# EAGLE board zx81a (EAGLE 7.6.0), part 1 of 3
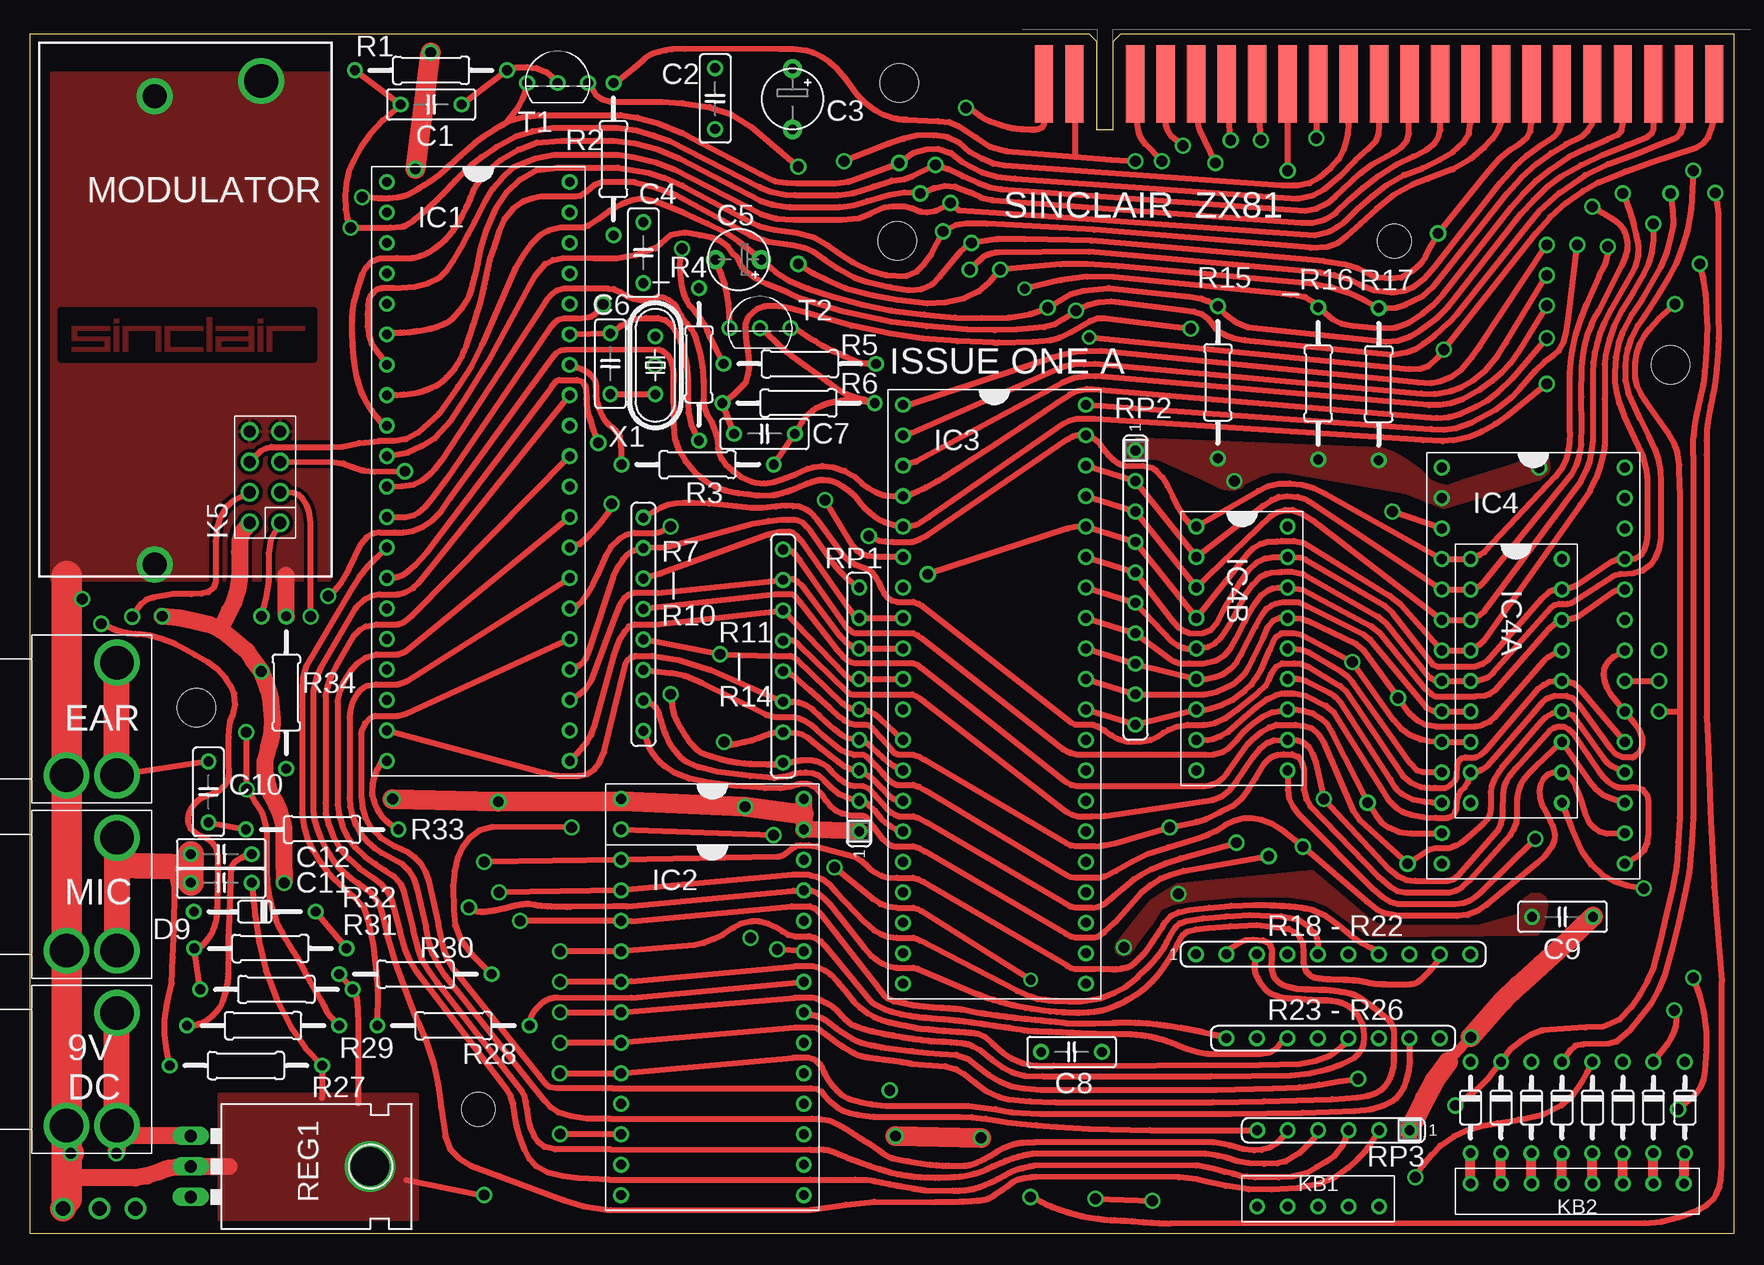
[diagram p1: board, top side]
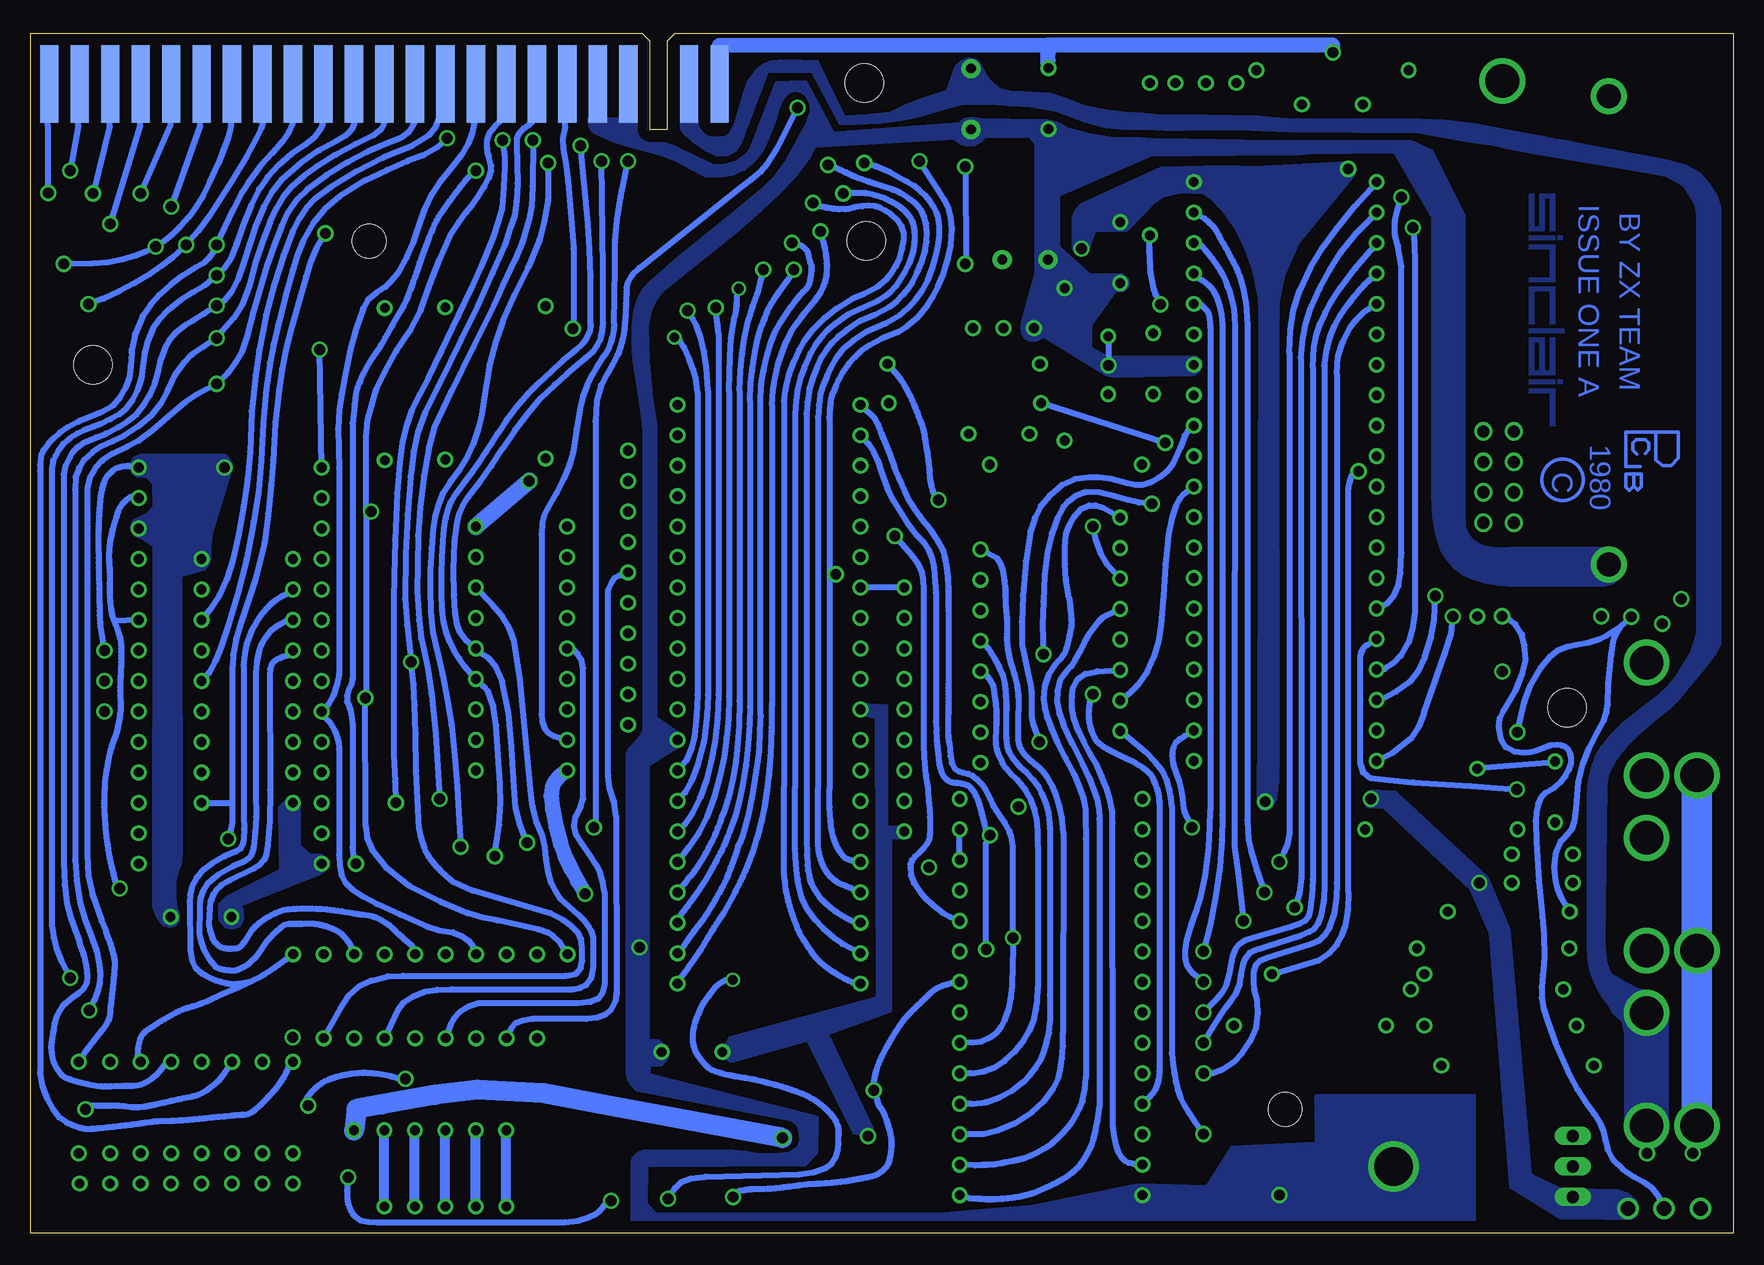
[diagram p2: board, bottom side, seen from below]

Size 142 x 100 mm. Coordinates in mm from the lower left corner, seen from the top.
Outline: 0,0 0,100 88.27,100 88.9,99.37 88.9,92 90.3,92 90.3,99.37 90.94,100 142,100 142,0 0,0
Copper layers (1*16): Top 0.035mm / dielectric 1.5mm / Bottom 0.035mm
Design rules "default *": minimum track width 10mil, minimum drill 24mil, track to track 8mil, track to pad 8mil, pad to pad 8mil, via to via 8mil, smd to smd 8mil, copper to edge 40mil, drill to drill 8mil, minimum pad ring 10mil, minimum via ring 8mil, stop-mask expansion 4mil, vias tented up to drill 0mil, thermal gap 10mil
Holes 3.2 mm at 13.88,43.81 72.45,95.88 72.3,82.71 136.75,72.39
Holes 2.8 mm at 113.73,82.71 37.37,10.31
tRestrict: 4 lines

## Footprints (pad centres in the part's own frame; a part is rotated, then mirrored left to right if it is on the bottom)
R207/12 = drill 0.813: 1 -6.35,0; 2 6.35,0
C025-025X050 = drill 0.813: 1 -2.54,0; 2 2.54,0
E5-5 = drill 0.813 pad 1.6: + -2.54,0; - 2.54,0
E3,8-5 = drill 0.813 pad 1.6: + -1.905,0; - 1.905,0
D10 = drill 0.813: A 3.81,0; C -3.81,0
D15 = drill 0.813: A 5.08,0; C -5.08,0
DIL40 = drill 0.813: 1 -7.62,24.13; 2 -7.62,21.59; 3 -7.62,19.05; 4 -7.62,16.51; 5 -7.62,13.97; 6 -7.62,11.43; 7 -7.62,8.89; 8 -7.62,6.35; 9 -7.62,3.81; 10 -7.62,1.27; 11 -7.62,-1.27; 12 -7.62,-3.81; 13 -7.62,-6.35; 14 -7.62,-8.89; 15 -7.62,-11.43; 16 -7.62,-13.97; 17 -7.62,-16.51; 18 -7.62,-19.05; 19 -7.62,-21.59; 20 -7.62,-24.13; 21 7.62,-24.13; 22 7.62,-21.59; 23 7.62,-19.05; 24 7.62,-16.51; 25 7.62,-13.97; 26 7.62,-11.43; 27 7.62,-8.89; 28 7.62,-6.35; 29 7.62,-3.81; 30 7.62,-1.27; 31 7.62,1.27; 32 7.62,3.81; 33 7.62,6.35; 34 7.62,8.89; 35 7.62,11.43; 36 7.62,13.97; 37 7.62,16.51; 38 7.62,19.05; 39 7.62,21.59; 40 7.62,24.13
DIL24/28 = drill 0.813: 1 -7.62,13.97; 2 -7.62,11.43; 3 -7.62,8.89; 4 -7.62,6.35; 5 -7.62,3.81; 6 -7.62,1.27; 7 -7.62,-1.27; 8 -7.62,-3.81; 9 -7.62,-6.35; 10 -7.62,-8.89; 11 -7.62,-11.43; 12 -7.62,-13.97; 13 -7.62,-16.51; 14 -7.62,-19.05; 15 7.62,-19.05; 16 7.62,-16.51; 17 7.62,-13.97; 18 7.62,-11.43; 19 7.62,-8.89; 20 7.62,-6.35; 21 7.62,-3.81; 22 7.62,-1.27; 23 7.62,1.27; 24 7.62,3.81; 25 7.62,6.35; 26 7.62,8.89; 27 7.62,11.43; 28 7.62,13.97
DIL28 = drill 0.813: 1 -7.62,13.97; 2 -7.62,11.43; 3 -7.62,8.89; 4 -7.62,6.35; 5 -7.62,3.81; 6 -7.62,1.27; 7 -7.62,-1.27; 8 -7.62,-3.81; 9 -7.62,-6.35; 10 -7.62,-8.89; 11 -7.62,-11.43; 12 -7.62,-13.97; 13 -7.62,-16.51; 14 -7.62,-19.05; 15 7.62,-19.05; 16 7.62,-16.51; 17 7.62,-13.97; 18 7.62,-11.43; 19 7.62,-8.89; 20 7.62,-6.35; 21 7.62,-3.81; 22 7.62,-1.27; 23 7.62,1.27; 24 7.62,3.81; 25 7.62,6.35; 26 7.62,8.89; 27 7.62,11.43; 28 7.62,13.97
DIL18 = drill 0.813: 1 -3.81,10.16; 2 -3.81,7.62; 3 -3.81,5.08; 4 -3.81,2.54; 5 -3.81,0; 6 -3.81,-2.54; 7 -3.81,-5.08; 8 -3.81,-7.62; 9 -3.81,-10.16; 10 3.81,-10.16; 11 3.81,-7.62; 12 3.81,-5.08; 13 3.81,-2.54; 14 3.81,0; 15 3.81,2.54; 16 3.81,5.08; 17 3.81,7.62; 18 3.81,10.16
ZX81CON = smd 1.524 x 6.477: A1 -27.94,-2.54; A2 -25.4,-2.54; A4 -20.32,-2.54; A5 -17.78,-2.54; A6 -15.24,-2.54; A7 -12.7,-2.54; A8 -10.16,-2.54; A9 -7.62,-2.54; A10 -5.08,-2.54; A11 -2.54,-2.54; A12 0,-2.54; A13 2.54,-2.54; A14 5.08,-2.54; A15 7.62,-2.54; A16 10.16,-2.54; A17 12.7,-2.54; A18 15.24,-2.54; A19 17.78,-2.54; A20 20.32,-2.54; A21 22.86,-2.54; A22 25.4,-2.54; A23 27.94,-2.54 | smd 1.524 x 6.477 bottom: B1 -27.94,-2.54; B2 -25.4,-2.54; B4 -20.32,-2.54; B5 -17.78,-2.54; B6 -15.24,-2.54; B7 -12.7,-2.54; B8 -10.16,-2.54; B9 -7.62,-2.54; B10 -5.08,-2.54; B11 -2.54,-2.54; B12 0,-2.54; B13 2.54,-2.54; B14 5.08,-2.54; B15 7.62,-2.54; B16 10.16,-2.54; B17 12.7,-2.54; B18 15.24,-2.54; B19 17.78,-2.54; B20 20.32,-2.54; B21 22.86,-2.54; B22 25.4,-2.54; B23 27.94,-2.54
ZXKLINKE = drill 2.8: 1 2.1,-4.7; 1' 2.1,4.7; 2 -2.1,-4.7
PINHEAD2X4 = drill 1.016: 1 -7.62,0; 2 -7.62,2.54; 3 -5.08,0; 4 -5.08,2.54; 5 -2.54,0; 6 -2.54,2.54; 7 0,0; 8 0,2.54
ZXKDB5 = drill 0.8: P$1 -5.08,0; P$2 -2.54,0; P$3 0,0; P$4 2.54,0; P$5 5.08,0
ZXKBD8 = drill 0.8: P$1 -8.89,0; P$2 -6.35,0; P$3 -3.81,0; P$4 -1.27,0; P$5 1.27,0; P$6 3.81,0; P$7 6.35,0; P$8 8.89,0
78XXL = drill 1.016 long: GND 0,0; IN -2.54,0; OUT 2.54,0
SIL9 = drill 0.813: 1 -10.16,0; 2 -7.62,0; 3 -5.08,0; 4 -2.54,0; 5 0,0; 6 2.54,0; 7 5.08,0; 8 7.62,0; 9 10.16,0
SIL10 = drill 0.813: 1 -11.43,0; 2 -8.89,0; 3 -6.35,0; 4 -3.81,0; 5 -1.27,0; 6 1.27,0; 7 3.81,0; 8 6.35,0; 9 8.89,0; 10 11.43,0
SIL6 = drill 0.813: 1 -6.35,0; 2 -3.81,0; 3 -1.27,0; 4 1.27,0; 5 3.81,0; 6 6.35,0
SIL8P = drill 0.813: 1 -8.89,0; 2 -6.35,0; 3 -3.81,0; 4 -1.27,0; 5 1.27,0; 6 3.81,0; 7 6.35,0; 8 8.89,0
SIL10P = drill 0.813: 1 -11.43,0; 2 -8.89,0; 3 -6.35,0; 4 -3.81,0; 5 -1.27,0; 6 1.27,0; 7 3.81,0; 8 6.35,0; 9 8.89,0; 10 11.43,0
TO92FLAT = drill 0.813: 1 0,0; 2 2.54,0; 3 -2.54,0
HC49 = drill 0.813: 1 -2.413,0; 2 2.413,0

## Placement (x,y rotation side)
_R4  18k  [R207/12]  55.76,72.42 270 top
_R16  [R207/12]  107.39,70.83 90 top
C1  47p  [C025-025X050]  33.44,94.09 0 top
C2  100n  [C025-025X050]  57.11,94.58 270 top
C3  22µ/16V  [E5-5]  63.56,94.54 270 top
C4  100n  [C025-025X050]  51.13,81.73 270 top
C5  1µ  [E3,8-5]  59.05,81.16 180 top
C6  [C025-025X050]  48.38,72.47 270 top
C7  47p  [C025-025X050]  61.22,66.64 0 top
C8  100n  [C025-025X050]  86.82,15.1 0 top
C9  100n  [C025-025X050]  127.74,26.37 180 top
C10  10n  [C025-025X050]  14.87,36.78 270 top
C11  47n  [C025-025X050]  15.94,29.21 0 top
C12  47p  [C025-025X050]  15.94,31.59 0 top
D1  [D10]  120.08,10.47 270 top
D2  [D10]  122.62,10.47 270 top
D3  [D10]  125.16,10.47 270 top
D4  [D10]  127.7,10.47 270 top
D5  [D10]  130.24,10.47 270 top
D6  [D10]  132.78,10.47 270 top
D7  [D10]  135.32,10.47 270 top
D8  [D10]  137.94,10.46 270 top
D9  [D15]  18.74,26.79 180 top
IC1  ZX81ULA  [DIL40]  37.37,63.5 0 top
IC2  ZX81ROM  [DIL24/28]  56.89,22.22 0 top
IC3  Z80CPU  [DIL40]  80.39,44.92 0 top
IC4  4816  [DIL28]  125.32,49.84 0 top
IC4A  2114  [DIL18]  123.89,46.03 0 top
IC4B  2114  [DIL18]  101.03,48.73 0 top
K1  ZX81CONN  [ZX81CON]  112.45,98.34 0 top
K2  MIC  [ZXKLINKE]  5.14,28.25 0 top
K3  EAR  [ZXKLINKE]  5.14,42.86 0 top
K4  DCIN  [ZXKLINKE]  5.14,13.65 0 top
K5  PINHEAD-2X4  [PINHEAD2X4]  20.86,66.83 90 top
KB1  ZXKBD5CON  [ZXKDB5]  107.38,2.22 180 top
KB2  ZXKBD8CON  [ZXKBD8]  128.97,4.12 0 top
R1  10k  [R207/12]  33.43,96.93 0 top
R2  680  [R207/12]  48.64,89.53 90 top
R3  not used  [R207/12]  55.65,64.07 0 top
R5  330  [R207/12]  64.17,72.47 180 top
R6  2k2  [R207/12]  64.07,69.2 0 top
R15  220k  [R207/12]  99.02,70.93 270 top
R17  1k  [R207/12]  112.43,70.77 270 top
R27  1k  [R207/12]  18,13.97 180 top
R28  680  [R207/12]  35.31,17.3 0 top
R29  1M  [R207/12]  19.43,17.3 0 top
R30  [R207/12]  32.13,21.59 180 top
R31  [R207/12]  20.54,20.32 180 top
R32  [R207/12]  20.04,23.73 0 top
R33  4k7  [R207/12]  24.35,33.65 0 top
R34  220  [R207/12]  21.36,45.06 270 top
REG1  7805  [78XXL]  13.4,5.55 270 top
RP1  not used  [SIL9]  69.12,43.65 90 top
RP2  10k  [SIL10]  92.14,53.81 270 top
RP3  RSIL5  [SIL6]  108.65,8.57 180 top
RP4  470  [SIL8P]  51.12,50.75 270 top
RP5  470  [SIL8P]  62.78,48.11 270 top
RP6  1k  [SIL8P]  108.62,16.25 0 top
RP7  [SIL10P]  108.62,23.25 0 top
T1  [TO92FLAT]  43.98,95.88 0 top
T2  [TO92FLAT]  60.85,75.44 0 top
X1  6,5MHz  [HC49]  52.12,72.34 270 top

## Tracks (layer width: path | path; a pad name or v marks a point on that pad's centre or on a via)
+5V  (via drill 0.9, 1.2)
  Top 0.5: R5.2 57.24,73.57 56.75,74.54 56.45,75.3 56.24,75.73 55.91,76.22 55.47,76.77 55.02,77.29 54.73,77.78 54.53,78.29 54.35,78.91 54.27,79.52 54.2,80.53 54.23,81.35 54.27,82.19 v54.36,82.07 | 49.28,36.03 IC2.1 | IC2.28
  Top 0.813: v120.1,16.33 118.22,14.26
  Top 1.422: IC2.28 64.52,34.92 IC2.27 RP1.1 | v11.02,51.43 12.39,51.31 13.79,51.02 15,50.73 15.84,50.3 | 15.84,50.3 16.07,50.18 16.73,49.65 17.47,49.01 18.07,48.53 18.57,47.76 v19.27,46.83 19.8,45.42 20.01,44.71 20.2,42.87 20.14,41.6 19.89,40.57 19.56,39.34 19.57,38.32 19.89,36.91 20.55,35.69 20.79,35.21 21.13,33.93 21.15,31.47 v21.18,29.21 | K5.2 17.68,58.43 17.5,57.7 17.46,56.76 17.46,54.77 17.32,53.65 16.99,52.59 16.59,51.83 15.84,50.3
  Top 1.676: v32.13,88.71 v33.4,98.42 | v30.23,36.19 v39.05,35.97 49.28,36.03 v59.59,35.56 64.52,34.92 | v120.1,16.33 122.78,19.34 124.06,20.62 125.94,22.32 128.27,24.43 C9.1 | 118.22,14.26 117.05,12.68 116.26,11.21 RP3.1 | v72.14,8.09 v79.28,7.93
  Bottom 0.5: IC4.28 133.61,63.94 133.79,63.93 133.97,63.92 134.15,63.91 134.33,63.88 134.5,63.85 134.66,63.8 134.81,63.74 134.96,63.65 135.09,63.55 135.22,63.44 135.35,63.32 135.47,63.2 135.59,63.07 135.69,62.94 135.75,62.81 135.81,62.67 135.86,62.52 135.9,62.37 135.94,62.22 135.98,62.08 136.02,61.93 136.07,61.7 136.1,61.46 136.13,61.22 136.16,60.98 136.18,60.74 136.2,60.5 136.22,60.26 136.24,60.04 136.25,59.82 136.26,59.6 136.27,59.38 136.27,59.16 136.28,58.94 136.29,58.72 136.29,58.38 136.3,58.03 136.3,57.69 136.29,57.34 136.29,57 136.29,56.65 136.29,56.31 136.28,55.88 136.27,55.45 136.26,55.02 136.25,54.59 136.24,54.16 136.23,53.73 136.22,53.3 136.21,52.94 136.21,52.59 136.21,52.24 136.2,51.88 136.2,51.53 136.18,51.17 136.15,50.82 136.13,50.57 136.09,50.32 136.06,50.07 136.02,49.83 135.97,49.58 135.93,49.33 135.89,49.08 v135.79,48.57 | IC2.26 IC2.27
  Bottom 1.27: v33.4,98.42 33.4,99.03 57.11,99.03 | C2.1 arc5 57.11,99.03 | 57.11,99.03 84.54,99 K1.B1
  Bottom 1.422: IC4B.18 v100.39,62.7
  Bottom 1.676: v79.28,7.93 94.59,10.79 99.19,11.66 104.72,11.96 108.27,11.51 112.67,10.72 114.78,10.34 RP3.1
  other vias: 125.79,63.81 8.79,2.06
  pour Top (no thermals): 92.61,66.19 112.62,65.4 113.57,65.08 114.68,64.45 115.79,63.66 116.75,62.7 117.38,62.38 118.17,62.23 119.44,62.7 123.57,63.97 124.84,64.45 125.95,64.77 126.43,64.61 126.59,64.13 126.59,63.66 126.43,63.34 125.79,62.86 117.86,60.48 114.68,61.75 105.63,63.34 104.52,63.5 103.57,63.5 102.62,63.18 101.25,62.51 100.94,62.19 100.66,62.11 100.17,62 99.59,62.08 99.12,62.23 97.85,62.86 94.36,64.45 93.89,64.61 91.82,64.61 91.5,64.93 91.34,65.24 91.34,65.56 91.66,65.88 92.3,66.19
  pour Bottom (no thermals): 72.78,44.07 70.61,43.96 70.61,33.81 68.77,33.81 68.77,33 70.29,33 70.29,18.51 75.55,16.61 71.81,8.74 72.08,8.09 73.33,8.36 77.18,16.12 83.52,14.33 84.34,14.88 83.63,16.29 71.37,19.6 71.43,42.93 72.89,43.41 72.79,44.06 71.75,43.62
  pour Bottom (no thermals): 13.36,3.63 9.63,3.52 8.83,3.23 8.22,2.73 8.02,2.1 8.14,1.5 8.63,1.2 10.65,1.25 14.39,1.26 18.57,3.87 20.29,25.02 21.86,28.66 29.24,35.57 30.07,35.57 30.53,35.57 30.74,36.01 30.74,36.38 30.48,36.72 30.05,36.85 28.2,36.75 20.55,29.66 18.74,25.33 16.93,4.87 14.45,3.67 13.38,3.65
  pour Bottom (no thermals): 32,89.25 39.91,88.81 42.34,88.92 47.71,88.77 54.34,85.75 54.75,85.29 55.02,84.65 55.02,82.14 54.71,81.65 54.19,81.58 53.89,81.84 53.28,83.58 51.74,83.6 51.24,83.58 51.14,83.58 50.82,83.6 50.62,83.6 50.4,83.8 48.35,85.9 47.6,86.42 46.69,86.69 45.75,86.8 44.21,86.72 43.53,86.27 42.47,85.18 41.5,83.79 40.63,82.13 40.06,80.47 39.86,79.68 39.68,78.7 39.54,78.01 39.49,76.8 39.56,40.67 39.6,37.61 39.61,35.82 39.35,35.37 38.87,35.34 38.56,35.52 38.31,35.91 38.2,36.17 38.14,36.61 38.02,37.58 37.97,40.1 38.03,74.14 38,77.63 37.54,79.83 36.35,82.47 31.78,88.07 31.52,88.67 31.69,89.11
  pour Bottom (no thermals): 125.88,64.85 132.79,64.83 133.25,64.64 133.51,64.16 133.53,63.77 133.44,63.42 133.07,63.11 132.24,63.07 131.68,62.48 131.63,60.56 132.22,59.89 132.79,59.67 133.36,59.34 133.51,58.88 133.46,58.51 133.16,58.14 132.57,57.88 131.66,57.29 131.68,27.22 131.33,26.27 130.92,25.74 130.37,25.59 129.85,25.72 129.63,26.03 129.63,26.55 129.85,27.16 129.96,27.96 129.96,29.4 129.74,30.14 129.5,30.8 129.41,31.6 129.43,54.83 127.47,55.38 127.23,55.64 127.04,56.18 127.04,57.08 126.91,58.36 125.32,63.53 125.23,64.05 125.36,64.4 125.62,64.72
+9V  (via drill 0.9)
  Top 1.422: REG1.IN 7.53,8.09 | 7.53,8.09 7.21,8.09 K4.1 | v7.21,6.66 7.53,8.09
  Top 2.184: K4.1 K4.1'
  pour Bottom (no thermals): 7.1,7.08 7.9,7.31 8.35,7.66 8.79,8.16 8.99,8.9 8.99,16.62 9.19,17.64 9.97,18.37 10.31,19 10.84,19.7 11.41,20.64 11.86,21.79 12.04,22.6 12.12,23.73 12.12,36.57 12.01,37.61 11.81,38.58 11.39,39.76 10.92,40.57 10.18,41.48 9.22,42.45 7.41,43.89 6.18,44.83 5.4,45.56 4.64,46.5 3.52,48.26 3,50 3,59 2.98,84.82 3.09,85.69 3.48,86.42 4.03,87.22 4.78,87.75 5.66,88.19 6.99,88.43 16.61,90.05 18.75,90.49 20.03,90.77 21.32,90.94 22.66,91.14 26.26,91.81 37.11,91.9 41.35,92.05 42.84,92.07 44.54,92.06 46.76,92 48.85,92.12 50.91,92.1 52.31,92.25 53.97,92.68 56.44,93.6 57.69,93.83 58.53,93.96 60.25,94.07 61.87,94.2 64.23,94.2 65.82,93.78 68.04,93.13 69.56,92.81 71.16,92.63 73.14,92.51 74.45,92.47 76.75,96.87 80.56,96.81 82.79,90.98 83.18,90.33 83.89,89.91 84.65,89.86 85.67,90.33 86.66,90.98 87.39,91.66 87.73,92.19 87.76,92.76 86.45,92.79 86.35,92.19 85.98,91.69 85.46,91.32 84.62,91.3 83.99,91.35 83.6,91.66 83.13,92.53 82.43,95.04 82.06,96.06 81.43,96.92 80.91,97.36 80.15,97.65 79,97.73 76.39,97.67 74.13,93.04 72.96,93.13 71.87,93.18 70.25,93.37 69.06,93.94 67.76,94.46 65.53,95.19 64.75,97.26 64.36,97.65 63.73,97.91 63.1,97.73 62.76,97.31 62.37,96.45 61.82,95.85 61.17,95.3 60.33,95.12 59.18,95.06 57.8,94.98 56.99,94.93 55.76,94.51 54.16,93.89 52.73,93.61 51.49,93.46 50.73,93.36 50.09,93.31 49.34,93.27 47.62,93.1 46.13,93.11 44.01,93.1 39.6,93.03 37.33,92.84 26.19,92.79 24.02,92.7 21.6,92.39 19.44,91.99 17.67,91.66 16.52,91.43 16.01,91.34 14.92,91.12 14.11,91.03 12.97,90.79 5.73,89.41 4.09,88.99 2.86,88.3 2.14,87.53 1.48,86.55 1.13,85.42 0.86,83.59 0.88,50.75 1.12,49.25 1.66,48.18 2.65,46.92 4.59,44.54 5.35,43.76 6.47,42.9 8.01,41.59 8.93,40.65 9.95,39.34 10.52,38.24 10.65,37.27 10.81,24.15 10.65,22.47 10.26,21.53 9.43,21.04 8.07,20.3 6.94,20.07 6.05,19.68 5.63,19.02 5.53,17.98 5.53,8.77 5.52,8.49 6.2,7.45 6.54,7.25
/BUSAK  (via drill 0.9)
  Top 0.5: 80.45,81.74 80.19,81.68 80.11,81.66 80.02,81.63 79.92,81.6 79.83,81.57 79.74,81.54 79.66,81.5 79.58,81.46 79.51,81.41 79.45,81.36 79.39,81.31 79.33,81.26 79.27,81.2 79.21,81.15 79.13,81.07 79.05,81 78.97,80.92 78.89,80.85 78.81,80.77 78.73,80.69 78.65,80.61 v78.33,80.32 | 80.45,81.74 80.72,81.76 | 80.45,81.74 88.28,81.81 107.63,80.06 108.71,79.88 109.91,79.55 110.85,79.08 112.14,78.59 113.43,78.41 114.55,78.59 115.37,78.91 116.25,79.58 117.1,80.55 122.53,87.54 123.76,88.89 124.76,89.82 126.08,90.76 126.99,91.38 127.43,91.85 127.66,92.47 K1.A18
  Bottom 0.5: v78.33,80.32 78.59,79.78 78.77,79.56 78.94,79.33 79.11,79.1 79.28,78.87 79.45,78.64 79.61,78.41 79.77,78.17 79.88,78.01 79.98,77.84 80.09,77.67 80.19,77.5 80.29,77.33 80.39,77.16 80.48,76.99 80.57,76.8 80.64,76.62 80.72,76.43 80.79,76.24 80.86,76.04 80.93,75.85 81,75.66 81.3,74.69 81.58,73.44 81.81,71.88 81.93,70.78 82,69.38 82,43.88 82.03,42.48 82.13,40.72 82.32,39.06 82.59,37.34 82.91,35.93 83.2,34.8 83.5,33.95 83.61,33.68 83.71,33.41 83.81,33.13 83.92,32.87 84.03,32.6 84.17,32.3 84.31,32 84.45,31.7 84.61,31.4 84.76,31.11 84.92,30.81 85.07,30.52 85.19,30.31 85.31,30.09 85.43,29.88 85.55,29.67 85.67,29.46 85.8,29.26 85.92,29.05 86.05,28.86 86.17,28.68 86.3,28.5 86.43,28.32 86.56,28.14 86.69,27.95 86.82,27.77 86.96,27.58 87.1,27.39 87.25,27.2 87.39,27.01 87.53,26.83 87.67,26.64 87.82,26.45 IC3.23
/BUSRQ  (via drill 0.8)
  Top 0.5: K1.A20 132.8,92.61 132.65,91.88 132.36,91.56 131.53,91.2 129.89,90.5 128.25,89.68 126.72,88.65 125.52,87.71 124.43,86.6 123.47,85.51 117.72,78.17 116.95,77.35 116.07,76.65 114.96,75.91 113.81,75.5 112.37,75.44 110.26,75.65 109.29,75.83 108.56,76.21 _R16.2 106.95,77.65 106.3,78.03 105.63,78.17 105.1,78.23 90.34,79.7 88.11,79.73 85.91,79.44 v82.93,78.74
  Bottom 0.5: IC3.25 87.09,32.14 86.24,33.38 85.55,34.73 84.94,36.44 84.48,38.15 84.13,39.67 83.94,41.28 83.79,42.92 83.75,44.75 83.75,70.25 83.66,73.04 83.56,74.61 83.28,76.38 83.22,76.59 83.18,76.8 83.15,76.98 83.13,77.16 83.12,77.34 83.11,77.53 83.1,77.71 83.09,77.89 83.08,78.08 v82.93,78.74
/HALT  (via drill 0.9)
  Top 0.5: R1.1 C1.1 29.38,92.75 28.37,91.61 27.61,90.56 27,89.41 26.58,88.48 26.36,87.48 26.26,86.5 26.31,85.35 26.43,84.6 v26.73,83.82 30.03,83.83 30.98,83.88 31.1,83.92 31.22,83.96 31.42,84.06 31.62,84.18 31.81,84.31 32,84.46 32.19,84.6 32.37,84.75 32.56,84.89 32.8,85.09 33.03,85.3 33.26,85.51 33.49,85.72 33.71,85.94 33.94,86.15 34.16,86.37 34.4,86.6 34.62,86.84 34.85,87.08 35.08,87.33 35.3,87.57 35.53,87.81 36.81,89.05 37.64,89.71 38.87,90.53 40.52,91.44 41.92,91.88 43.54,92.14 48.97,92.14 50.52,91.94 52.02,91.5 53.28,91.06 60.82,87.21 61.79,86.8 62.99,86.57 63.75,86.54 67.33,86.54 68.6,86.71 70.3,87.24 71.85,87.74 72.85,87.86 73.53,88.09 v75.47,89.06 76.55,88.71 77.75,88.09 79.1,87.51 80.04,87.18 80.95,87.04 106.29,85.22 107.24,85.39 108.18,85.86 108.85,86.45 109.47,87.04 110.91,88.36 111.88,89.09 113.64,90.09 114.37,90.59 114.75,91.06 114.96,91.67 K1.A13
  Bottom 0.5: v75.47,89.06 74.91,88.84 74.77,88.78 74.63,88.71 74.49,88.64 74.35,88.57 74.22,88.51 74.08,88.44 73.95,88.38 73.83,88.33 73.7,88.27 73.58,88.21 73.46,88.15 73.33,88.09 73.21,88.04 73.05,87.98 72.88,87.92 72.72,87.86 72.56,87.81 72.39,87.75 72.23,87.7 72.07,87.64 71.85,87.56 71.63,87.49 70.06,86.97 69.5,86.73 68.73,86.24 68.25,85.88 67.92,85.52 67.7,85.25 67.46,84.75 67.29,84.16 67.24,83.46 67.25,82.62 67.38,81.85 67.67,80.92 68.07,80.04 68.46,79.26 68.82,78.72 69.19,78.26 69.8,77.63 70.36,77.2 71.59,76.54 72.89,76 73.87,75.34 74.62,74.74 75.13,74.23 75.6,73.64 76.03,73.01 76.38,72.18 76.72,71.38 77.03,70.43 77.2,69.24 77.28,68.31 77.27,32.91 77.25,31.55 77.2,30.69 77.15,30.28 77.01,29.68 76.97,29.55 76.93,29.41 76.89,29.28 76.84,29.14 76.79,29.02 76.71,28.86 76.63,28.71 76.54,28.56 76.45,28.41 76.35,28.26 76.26,28.11 76.15,27.98 76.07,27.88 75.98,27.79 75.89,27.7 75.8,27.61 75.7,27.52 75.61,27.43 75.52,27.34 75.4,27.24 75.27,27.14 75.15,27.04 75.03,26.95 74.9,26.86 74.77,26.76 74.64,26.67 74.49,26.57 74.34,26.48 74.18,26.39 74.02,26.3 73.86,26.21 73.7,26.12 73.54,26.04 IC3.18 | v26.73,83.82 26.62,82.62 26.55,80.75 26.55,51.79 26.76,50.37 27.06,49.31 27.72,48.14 28.33,47.53 29.09,47.02 IC1.17
/IORQ  (via drill 0.9)
  Top 0.5: K1.A15 120.08,92.55 119.94,91.62 119.5,90.94 118.62,90.12 117.51,89.47 116.1,88.8 114.52,88.21 113.08,87.36 111.85,86.42 110.7,85.42 109.59,84.34 108.94,83.87 108.3,83.49 107.06,83.19 88.02,84.57 77.43,85.28 v76.74,85.88 75.55,85.25 74.76,85.1 74.23,85.16 73.64,85.42 72.91,85.6 71.88,85.6 71.24,85.51 70.03,84.98 69.09,84.6 67.66,84.48 63.7,84.48 62.2,84.57 60.97,84.92 53.69,88.68 52.16,89.27 50.38,89.68 49.02,89.88 43.66,89.88 42.13,89.59 40.34,88.89 39.31,87.92 38.61,87.1 37.93,85.98 37.05,84.28 36.52,83.31 35.88,82.11 35.26,81.02 34.76,80.29 34.09,79.61 33.21,79.2 32.06,78.9 30.34,78.79 29.31,78.78 28.92,78.67 28.66,78.44 28.39,78.15 28.25,77.79 28.17,77.35 28.13,76.59 28.14,75.58 28.26,74.81 28.5,74.13 28.91,73.52 29.26,73.05 IC1.7
  Bottom 0.5: v76.74,85.88 76.17,85.61 76.05,85.58 75.93,85.56 75.81,85.53 75.69,85.51 75.57,85.49 75.45,85.46 75.34,85.45 75.24,85.43 75.13,85.42 75.03,85.4 74.92,85.39 74.82,85.37 74.71,85.36 74.57,85.36 74.01,85.35 73.7,85.39 73.25,85.52 72.63,85.61 72.07,85.66 71.52,85.6 71.17,85.49 70.73,85.25 70.24,84.93 69.65,84.42 69.33,83.95 69.16,83.36 69.16,82.83 69.3,82.03 69.48,81.36 69.8,80.65 70.2,80.03 70.65,79.47 71.39,78.87 72.5,78.31 73.41,77.94 74.75,77.08 75.78,76.3 76.78,75.27 77.44,74.39 77.91,73.58 78.32,72.65 78.71,71.55 79,70.28 79.13,69.28 79.14,37.28 79.15,30.08 79.06,29.31 78.96,28.53 78.91,28.29 78.86,28.04 78.83,27.91 78.8,27.78 78.77,27.64 78.73,27.51 78.7,27.37 78.66,27.24 78.63,27.11 78.58,26.95 78.53,26.8 78.48,26.65 78.42,26.49 78.37,26.34 78.31,26.19 78.26,26.04 78.2,25.88 78.14,25.73 78.08,25.57 78.02,25.42 77.96,25.27 77.89,25.11 77.82,24.97 77.74,24.81 77.65,24.65 77.55,24.5 77.45,24.35 77.35,24.2 77.25,24.05 77.16,23.89 77.07,23.76 76.98,23.63 76.89,23.5 76.8,23.37 76.71,23.24 76.62,23.11 76.52,22.99 76.42,22.89 76.32,22.78 76.21,22.68 76.11,22.58 76,22.48 75.89,22.38 75.78,22.29 75.61,22.16 75.44,22.03 75.27,21.91 75.09,21.79 74.91,21.68 74.73,21.56 74.55,21.45 74.4,21.37 74.25,21.29 74.11,21.21 73.96,21.14 73.81,21.06 73.66,20.99 73.51,20.92 IC3.20
/M1  (via drill 0.9)
  Top 0.5: K1.A22 137.81,92.24 137.61,91.73 137.25,91.34 135.73,90.72 133.95,89.99 131.53,89.11 129.64,88.21 127.47,86.71 125.8,85.17 124.9,84.09 118.99,76.63 118.26,75.9 117.09,74.83 116.17,74.16 115.48,73.68 114.76,73.43 113.58,73.22 101.23,74.46 100.35,74.61 99.57,74.9 98.83,75.39 98.2,76.22 97.68,76.63 97.01,76.82 96.18,76.94 90.13,77.69 89.08,77.59 88.27,77.4 v87.19,76.89 86.15,76.21 85.4,75.75 84.54,75.51 83.21,75.41 82.23,75.33 80.41,75.27 78.13,75.33 74.76,75.6 71.83,75.95 67.76,76.83 64.24,77.92 63.09,78.46 61.41,79.12 60.42,79.62 59.88,80.01 59.41,80.47 59.19,80.83 58.92,81.37 58.66,81.58 58.2,82.23 57.57,82.69 56.82,82.98 55.82,83.18 54.58,83.38 53.36,83.19 52.16,82.09 50.51,81.51 48.92,81.25 47,81.25 44.36,81.27 43.59,81.12 42.93,80.79 42.17,79.89 41.63,78.98 38.22,72.68 36.27,69.52 35.14,67.82 33.73,66.26 32.64,65.61 31.48,65.06 IC1.10
  Bottom 0.5: IC3.27 87.39,36.73 86.87,37.71 86.33,39.01 85.82,41.01 85.58,43.24 85.5,44.88 85.5,70.25 85.62,72.12 85.8,73.47 86.06,74.56 86.45,75.66 86.76,76.22 v87.19,76.89
/MREQ  (via drill 0.9)
  Top 0.5: IC1.9 29.24,67.62 29.12,67.75 29.01,67.88 28.9,68.02 28.79,68.16 28.69,68.29 28.58,68.43 28.48,68.57 28.35,68.78 28.22,68.99 28.1,69.21 27.98,69.42 27.86,69.64 27.75,69.86 27.65,70.09 27.55,70.34 27.47,70.6 27.39,70.86 27.32,71.12 27.25,71.38 27.19,71.65 27.13,71.91 27.09,72.17 27.05,72.42 27.02,72.68 27,72.94 26.97,73.19 26.95,73.45 26.93,73.71 26.91,73.97 26.9,74.23 26.88,74.49 26.87,74.75 26.86,75.01 26.85,75.28 26.85,75.54 26.85,75.76 26.86,75.99 26.87,76.22 26.88,76.45 26.89,76.68 26.9,76.9 26.93,77.13 26.98,77.39 27.04,77.66 27.11,77.92 27.18,78.18 27.25,78.44 27.33,78.7 27.41,78.96 27.49,79.21 27.57,79.47 27.66,79.72 27.75,79.97 28.03,80.51 28.49,81.01 29.17,81.27 30.41,81.27 30.6,81.29 30.8,81.27 30.99,81.27 31.13,81.27 31.27,81.27 31.42,81.27 31.56,81.27 31.7,81.28 31.84,81.29 31.98,81.31 32.15,81.34 32.32,81.39 32.49,81.45 32.65,81.5 32.82,81.57 32.98,81.63 33.14,81.7 33.33,81.81 33.51,81.92 33.69,82.05 33.86,82.18 34.04,82.31 34.21,82.44 34.37,82.58 34.53,82.73 34.67,82.88 34.82,83.04 34.96,83.2 35.1,83.36 35.24,83.53 35.37,83.69 35.55,83.97 35.72,84.25 35.88,84.54 36.03,84.83 36.19,85.13 36.33,85.43 36.48,85.72 36.59,85.95 36.69,86.19 36.78,86.42 36.88,86.66 36.98,86.9 37.08,87.13 37.2,87.35 38.14,88.5 39.28,89.47 40.72,90.32 42.25,90.91 44.27,91.06 48.67,91.06 50.38,90.85 52.31,90.35 54.1,89.59 60.88,86.07 61.91,85.75 63.31,85.54 67.51,85.54 68.68,85.69 69.8,86.04 71.65,86.57 72.88,86.77 v74.2,86.67 75.34,87.12 76.25,87.3 77.11,87.24 78.43,86.74 79.31,86.3 80.22,86.13 105.99,84.22 106.92,84.22 107.92,84.49 108.82,85.01 110,86.16 111.08,87.12 112.43,88.15 113.87,89.06 115.31,89.74 116.34,90.26 117.07,90.82 117.39,91.32 117.57,91.97 K1.A14
  Bottom 0.5: IC3.19 74.29,24.09 74.95,24.58 75.88,25.41 76.56,26.1 77.32,27.17 77.64,27.88 77.86,28.71 78,29.5 78.15,30.74 78.22,32.06 78.23,37.13 78.22,68.26 78.13,69.41 78.01,70.36 77.76,71.35 77.45,72.21 76.94,73.33 76.52,74.06 75.91,74.84 75.47,75.3 75.04,75.69 73.77,76.59 71.28,77.75 70.68,78.12 70.24,78.48 69.85,78.92 69.54,79.34 69.1,80.09 68.75,80.8 68.51,81.45 68.47,81.57 68.43,81.69 68.4,81.82 68.37,81.95 68.34,82.09 68.32,82.23 68.3,82.37 68.29,82.51 68.27,82.65 68.27,82.79 68.26,82.92 68.26,83.05 68.26,83.18 68.27,83.31 68.27,83.44 68.28,83.56 68.3,83.69 68.32,83.81 68.35,83.93 68.38,84.04 68.41,84.16 68.44,84.27 68.48,84.39 68.53,84.49 68.59,84.6 68.66,84.71 68.74,84.81 68.82,84.91 68.9,85.01 68.98,85.1 69.07,85.2 69.14,85.27 69.22,85.34 69.3,85.41 69.39,85.47 69.47,85.54 69.55,85.6 69.64,85.66 69.73,85.73 69.83,85.79 69.93,85.85 70.03,85.9 70.14,85.96 70.24,86.01 70.34,86.07 70.45,86.12 70.56,86.18 70.67,86.23 71.62,86.53 72.33,86.69 v74.2,86.67
/NMI  (via drill 0.9)
  Top 0.5: 39.73,92.6 39.59,92.52 39.42,92.42 39.25,92.32 39.08,92.22 38.91,92.12 38.7,91.99 38.49,91.86 38.28,91.73 38.08,91.6 37.87,91.46 37.67,91.33 37.46,91.19 37.34,91.08 37.21,90.97 37.08,90.86 36.95,90.75 36.82,90.64 36.69,90.52 36.56,90.41 36.39,90.26 36.21,90.1 36.04,89.95 35.86,89.79 35.69,89.64 35.51,89.48 35.34,89.32 35.16,89.17 34.99,89.01 34.82,88.85 34.65,88.69 34.48,88.54 34.31,88.38 34.13,88.24 33.91,88.07 33.7,87.92 33.48,87.77 33.25,87.62 33.02,87.48 32.8,87.34 32.57,87.19 32.38,87.07 32.2,86.96 32.02,86.84 31.83,86.74 31.64,86.64 31.44,86.56 31.24,86.49 31.15,86.46 31.05,86.44 30.96,86.41 30.87,86.4 30.77,86.38 30.67,86.36 30.58,86.34 30.26,86.3 29.94,86.28 29.62,86.27 29.3,86.28 28.98,86.29 28.66,86.32 28.33,86.34 v27.69,86.36 | 39.73,92.6 39.76,92.62 39.94,92.72 41.07,93.02 42.42,93.2 49.26,93.2 50.61,93 52.34,92.53 54.4,91.7 60.91,88.27 62.08,87.71 63.08,87.56 63.87,87.51 67.16,87.51 68.22,87.65 v72.45,89.21 73.64,90.06 74.73,90.35 75.67,90.38 76.78,90.03 77.72,89.3 79.31,88.45 80.6,88.06 82.09,87.92 105.69,86.25 106.98,86.51 107.92,87.04 109.21,88.09 110.44,89.38 111.61,90.44 112.23,91.09 112.43,91.65 112.46,92.29 K1.A12 | T1.3 41.24,95.05 41.03,94.52 40.78,94.05 40.47,93.55 39.73,92.6
  Bottom 0.5: IC3.17 73.47,28.71 73.55,28.75 73.62,28.78 73.69,28.82 73.76,28.85 73.84,28.88 73.91,28.91 74,28.95 74.1,28.99 74.2,29.03 74.3,29.06 74.39,29.1 74.49,29.14 74.58,29.18 74.7,29.25 74.81,29.33 74.92,29.42 75.04,29.5 75.14,29.59 75.25,29.69 75.35,29.78 75.42,29.87 75.49,29.97 75.56,30.06 75.63,30.16 75.69,30.25 75.76,30.35 75.82,30.45 75.88,30.58 75.94,30.71 76,30.85 76.05,30.98 76.1,31.12 76.14,31.25 76.18,31.39 76.21,31.52 76.24,31.65 76.25,31.78 76.32,32.51 76.31,37.13 76.31,68 76.25,68.99 76.14,69.87 75.92,70.58 75.57,71.45 75.26,72.09 74.8,72.94 74.17,73.74 73.36,74.42 72.31,75.12 70.7,75.82 69.52,76.49 68.81,77.12 68.14,77.86 67.62,78.61 67.17,79.45 66.8,80.38 66.53,81.31 66.32,82.23 66.19,83.12 66.19,83.78 66.25,84.3 66.33,84.78 66.46,85.09 66.67,85.56 66.97,86.03 67.36,86.49 67.86,86.96 68.27,87.28 68.93,87.67 70.35,88.44 71.54,88.93 v72.45,89.21 | IC1.15 28.84,52.5 28.28,53.21 27.92,53.97 27.77,54.99 27.67,56.71 27.67,80.6 27.97,82.28 28.23,83.24 28.23,84.31 28.07,85.12 27.87,85.83 v27.69,86.36
/RAMCS  (via drill 0.9)
  Top 0.5: R2.2 49.18,96.19 49.39,96.35 49.6,96.52 49.81,96.69 50.02,96.86 50.23,97.03 50.44,97.2 50.64,97.37 50.86,97.56 51.08,97.75 51.29,97.94 51.75,98.26 52.05,98.38 52.46,98.48 52.99,98.6 53.51,98.68 54.57,98.73 62.46,98.71 63.61,98.7 64.7,98.58 65.3,98.39 65.99,98.05 66.65,97.61 67.25,97.1 68,96.25 68.45,95.59 68.98,94.84 69.62,94.2 70.49,93.57 71.2,93.2 71.77,93.02 71.93,92.98 72.09,92.94 72.25,92.91 72.42,92.88 72.58,92.85 72.75,92.83 72.93,92.83 73.1,92.83 75.67,92.7 76.64,92.61 77.43,92.26 78.89,91.32 80.01,90.59 81.39,90.21 87.09,89.73 | IC4B.8 98.16,41.09 98.58,41.17 99.19,41.39 99.87,41.76 101.21,43 102.19,43.82 103.09,44.49 103.82,44.84 104.4,44.97 104.61,44.99 104.83,45 105.04,45 105.26,44.99 105.47,44.97 106.33,44.81 108.03,43.96 108.65,43.43 109.03,42.81 113.22,36.12 113.87,35.5 114.46,35.12 115.25,34.86 116.36,34.65 117.19,34.62 118.12,34.62 118.65,34.83 118.8,35.09 118.92,35.41 118.95,35.91 119.03,36.35 119.24,36.82 119.59,37.15 119.86,37.59 IC4A.8 120.57,38.44 120.97,38.62 121.53,38.99 125.38,43.45 125.99,44.14 126.46,44.57 126.9,44.74 127.09,44.82 128.06,44.8 128.59,44.59 129.04,44.1 131.69,40.5 132.22,39.91 132.79,39.66 133.56,39.64 133.75,39.72 134.07,39.97 134.26,40.29 134.38,40.8 134.4,41.23 134.16,41.88 133.71,42.55 IC4.20 131.77,44.92 131.47,45.45 131.28,46.04 131.2,46.53 131.22,46.98 131.41,47.38 131.67,47.77 131.98,48.04 IC4.22 | 87.09,89.73 90.14,89.48 v92.14,89.37 | K1.A2 87.09,89.73
  Bottom 0.5: v92.14,89.37 92.75,86.33 93.07,84.43 93.21,82.63 93.25,80.5 93.3,75.81 93.32,75.53 93.34,75.25 93.39,74.98 93.43,74.8 93.48,74.61 93.53,74.43 93.59,74.24 93.65,74.06 93.72,73.88 93.79,73.71 93.88,73.55 93.97,73.39 94.08,73.23 94.19,73.08 94.3,72.93 94.7,72.31 95.09,71.6 95.58,70.65 95.9,69.82 96.14,68.77 96.44,67 96.73,65.07 97.03,64.07 97.54,62.85 98.1,61.72 98.81,60.5 99.13,59.84 99.3,59.18 99.38,58.25 99.38,43.25 99.3,42.65 99.1,42.06 98.79,41.7 98.37,41.45 IC4B.8
/RD  (via drill 0.9)
  Top 0.5: IC1.6 30.02,75.04 30.31,75.05 30.59,75.06 30.88,75.07 31.16,75.09 31.45,75.1 31.73,75.13 32.01,75.16 32.25,75.2 32.49,75.23 32.73,75.27 32.98,75.32 33.21,75.36 33.45,75.42 33.68,75.48 33.87,75.54 34.05,75.61 34.23,75.67 34.41,75.74 34.58,75.82 34.76,75.9 34.92,76 35.07,76.11 35.21,76.24 35.35,76.38 35.49,76.52 35.62,76.66 35.75,76.81 35.87,76.95 35.99,77.1 36.1,77.26 36.2,77.42 36.3,77.58 36.41,77.74 36.5,77.9 36.59,78.07 36.69,78.31 36.77,78.55 36.84,78.8 36.91,79.06 36.98,79.31 37.04,79.56 37.11,79.82 37.18,80.13 37.25,80.45 37.32,80.77 37.38,81.09 37.44,81.41 37.51,81.73 37.58,82.05 38.02,83.54 38.87,85.45 39.72,86.74 40.87,87.83 42.19,88.59 44.01,88.83 49,88.83 51.58,88.39 52.93,87.95 54.37,87.33 59.44,84.63 60.76,83.96 62.02,83.63 63.9,83.4 65.34,83.02 66.48,82.34 67.48,81.64 68.63,80.9 70.03,80.23 71.36,79.88 73.06,79.79 73.91,80.14 74.49,80.73 75.11,81.55 v76.11,83.5 77.19,84.04 78.05,84.16 79.78,84.13 88.72,83.63 106.77,82.14 108.15,82.22 109.06,82.58 109.73,83.1 110.91,84.16 112.26,85.42 113.67,86.54 115.22,87.39 116.54,87.89 118.62,88.68 120.06,89.53 121.21,90.47 121.91,91.23 122.32,91.88 122.61,92.61 K1.A16
  Bottom 0.5: v76.11,83.5 75.91,82.75 75.86,82.58 75.82,82.41 75.78,82.24 75.75,82.06 75.71,81.89 75.68,81.72 75.66,81.59 75.65,81.46 75.63,81.33 75.61,81.2 75.6,81.07 75.59,80.94 75.58,80.81 75.58,80.65 75.58,80.48 75.59,80.31 75.59,80.14 75.61,79.97 75.62,79.81 75.65,79.64 75.69,79.47 75.74,79.3 75.8,79.13 75.87,78.96 75.93,78.79 76,78.63 76.08,78.47 76.16,78.35 76.23,78.22 76.31,78.1 76.4,77.99 76.48,77.87 76.57,77.75 76.65,77.63 76.75,77.51 76.86,77.38 76.96,77.26 77.07,77.14 77.18,77.01 77.28,76.89 77.39,76.76 77.48,76.65 77.57,76.53 77.66,76.41 77.75,76.29 77.84,76.17 77.93,76.05 78.03,75.93 78.12,75.81 78.21,75.69 78.59,75.07 78.94,74.34 79.28,73.49 79.63,72.41 79.91,71.24 80.08,70.27 80.17,69.03 80.17,44.11 80.17,43.78 80.17,43.45 80.18,43.12 80.18,42.79 80.19,42.46 80.19,42.13 80.2,41.8 80.21,41.4 80.23,41 80.24,40.61 80.26,40.21 80.28,39.81 80.3,39.42 80.33,39.02 80.36,38.76 80.38,38.5 80.41,38.25 80.44,37.99 80.47,37.73 80.5,37.47 80.53,37.21 80.57,36.93 80.61,36.64 80.65,36.35 80.69,36.06 80.74,35.78 80.78,35.49 80.83,35.21 80.88,34.98 80.93,34.76 80.98,34.54 81.04,34.32 81.09,34.1 81.15,33.88 81.2,33.67 81.29,33.36 81.37,33.06 81.46,32.76 81.55,32.46 81.64,32.16 81.74,31.85 81.84,31.56 81.92,31.34 82,31.12 82.09,30.91 82.17,30.69 82.26,30.48 82.35,30.27 82.44,30.05 82.55,29.81 82.66,29.58 82.77,29.34 82.89,29.11 83.01,28.88 83.12,28.64 83.25,28.41 84.21,26.66 84.37,26.42 84.53,26.18 84.68,25.94 84.84,25.69 85,25.45 85.15,25.2 85.3,24.96 85.45,24.71 85.59,24.47 85.74,24.22 85.89,23.98 86.03,23.73 86.19,23.49 86.28,23.35 86.38,23.21 86.47,23.08 86.57,22.94 86.67,22.8 86.76,22.66 86.86,22.52 86.98,22.35 87.1,22.18 87.23,22 87.35,21.83 87.48,21.66 87.6,21.49 87.73,21.32 IC3.21
/RESET  (via drill 0.9)
  Top 0.5: K1.A21 135.35,92.09 135.2,91.7 134.79,91.35 133.09,90.71 131.09,89.88 129.31,89.03 127.66,88.09 126.49,87.24 125.34,86.13 124.32,85.01 118.18,77.21 117.22,76.24 115.87,75.24 115.02,74.74 114.02,74.39 113.05,74.3 101.52,75.53 100.52,75.94 99.73,76.53 R15.1 98.2,77.71 97.64,77.91 96.68,78.06 89.93,78.79 87.81,78.56 86.73,78.26 v84.84,77.15 83.38,76.62 81.6,76.33 79.32,76.28 77.12,76.33 74.54,76.58 71.8,76.92 69.39,77.38 66.94,78.06 64.86,78.74 63.26,79.41 62.12,80.13 C5.+ 59.13,82.61 57.97,83.4 56.45,84.16 54.46,85.07 52.28,85.94 50.98,86.23 50.25,86.12 49.31,85.76 48.33,85.25 47.43,84.56 46.56,83.98 46.09,83.84 44.24,83.84 43.19,83.55 42.46,83.15 41.74,82.39 41.12,81.52 40.43,80.4 37.68,74.09 36.77,72.24 35.69,70.57 34.09,68.32 32.35,66.73 31.34,66.19 30.4,66.04 29.09,66.04 27.47,65.88 26.06,65.57 25.25,65.53 20.14,65.53 19.7,65.43 19.23,65.21 K5.6
  Bottom 0.5: IC3.26 87.39,34.09 86.77,35.02 86.16,36.29 85.6,37.81 85.21,39.3 84.89,41.04 84.7,42.97 84.62,44.88 84.62,75 84.68,75.73 v84.84,77.15
/RFSH  (via drill 0.8, 0.9)
  Top 0.5: K1.A23 140.4,92.87 140.16,92.04 139.91,91.36 139.47,90.85 138.86,90.48 135.14,89.26 132.97,88.5 130.69,87.57 129.45,86.86 128.08,85.88 126.73,84.69 125.57,83.4 v117.86,73.66 117.34,72.97 116.64,72.34 115.9,72.07 115,72.04 v88.29,74.68
  Bottom 0.5: IC3.28 87.31,39.37 86.87,40.43 86.6,41.48 86.46,43.14 86.38,44.88 86.38,70.12 86.49,71.19 86.72,72.01 87.05,72.89 87.46,73.83 87.84,74.45 v88.29,74.68 | IC4.1 v117.86,73.66
/ROMCS  (via drill 0.9)
  Top 0.5: R28.2 41.74,17.59 41.74,17.66 41.74,17.74 41.75,17.81 41.75,17.89 41.76,17.96 41.78,18.03 41.8,18.1 41.83,18.17 41.87,18.24 41.91,18.31 41.96,18.38 42,18.45 42.05,18.52 42.15,18.65 42.26,18.78 42.38,18.9 42.5,19.02 42.63,19.13 42.76,19.24 42.89,19.33 42.97,19.38 43.06,19.42 43.14,19.46 43.23,19.49 43.31,19.53 43.4,19.56 43.48,19.59 43.65,19.62 43.82,19.63 44,19.63 50.12,19.62 IC2.22 | v83.41,3.01 83.79,2.9 83.97,2.79 84.15,2.69 84.33,2.58 84.52,2.49 84.71,2.39 84.89,2.31 85.08,2.24 85.27,2.16 85.46,2.09 85.65,2.02 85.84,1.95 86.03,1.89 86.26,1.81 86.5,1.74 86.74,1.67 86.97,1.6 87.21,1.53 87.45,1.47 87.69,1.41 87.95,1.36 88.21,1.31 88.47,1.27 88.73,1.23 88.99,1.19 89.26,1.16 89.52,1.13 89.8,1.1 90.08,1.08 90.36,1.07 90.64,1.06 90.92,1.05 91.21,1.03 91.49,1.02 91.81,0.99 92.14,0.97 92.47,0.94 92.79,0.92 93.12,0.89 93.44,0.87 93.77,0.85 94.09,0.83 94.41,0.82 94.73,0.81 95.05,0.8 134.58,0.84 135.99,0.95 137.41,1.31 139.1,1.94 139.79,2.37 140.34,2.85 140.58,3.24 140.82,3.82 140.94,4.42 141.01,5.54 141.04,20.97 140.69,25.04 140.38,28.86 140.24,31.95 140.08,35.25 139.9,40.42 139.75,43 139.75,64.88 139.76,66.09 139.79,67 139.86,67.61 139.99,68.37 140.1,69 140.27,69.82 140.42,70.65 140.59,72.09 140.69,73.26 140.76,74.62 140.76,75.72 140.76,75.97 140.75,76.24 140.75,85 140.66,85.89 v140.49,86.72
  Bottom 0.5: K1.B23 140.51,92.32 140.51,87.1 v140.49,86.72 | 71.67,12.42 71.66,12.55 71.65,12.68 71.63,12.81 71.61,12.94 71.59,13.06 71.56,13.19 71.53,13.32 71.49,13.49 71.44,13.65 71.38,13.81 71.32,13.98 71.26,14.14 71.2,14.3 71.13,14.46 71.05,14.63 70.97,14.8 70.89,14.97 70.8,15.13 70.71,15.3 70.62,15.47 70.53,15.63 70.45,15.77 70.37,15.91 70.29,16.05 70.21,16.19 70.13,16.33 70.05,16.46 69.96,16.6 69.86,16.77 69.75,16.93 69.64,17.1 69.53,17.26 69.42,17.42 69.31,17.58 69.19,17.74 69.07,17.88 68.94,18.02 68.81,18.16 68.68,18.3 68.55,18.44 68.42,18.57 68.29,18.71 68.17,18.82 68.06,18.93 67.95,19.04 67.83,19.15 67.72,19.26 67.6,19.37 67.48,19.48 67.35,19.6 67.22,19.73 67.09,19.85 66.96,19.98 66.83,20.1 66.69,20.21 66.55,20.31 66.36,20.42 66.16,20.52 65.96,20.6 65.75,20.67 65.54,20.73 65.33,20.79 65.11,20.85 IC2.22 | 71.67,12.42 71.66,12.27 | 71.61,11.97 71.64,12.12 71.67,12.42 | 71.61,11.97 71.58,11.82 71.54,11.67 71.5,11.53 71.47,11.38 71.43,11.25 71.39,11.11 71.36,10.97 71.32,10.84 71.27,10.71 71.21,10.58 71.13,10.48 71.13,10.47 71.12,10.47 71.11,10.46 71.11,10.45 71.1,10.45 71.1,10.44 71.01,10.33 70.94,10.21 70.88,10.08 70.82,9.94 70.77,9.81 70.72,9.67 70.66,9.54 70.61,9.4 70.57,9.27 70.52,9.13 70.48,8.99 70.44,8.85 70.4,8.71 70.36,8.57 70.33,8.45 70.31,8.32 70.28,8.2 70.25,8.07 70.23,7.95 70.21,7.83 70.19,7.7 70.19,7.55 70.19,7.39 70.2,7.24 70.21,7.09 70.22,6.93 70.24,6.78 70.26,6.63 70.28,6.5 70.31,6.36 70.34,6.23 70.37,6.1 70.4,5.97 70.44,5.84 70.5,5.73 70.55,5.64 70.6,5.56 70.66,5.48 70.72,5.41 70.79,5.34 70.86,5.26 70.93,5.19 71.02,5.13 71.12,5.06 71.21,5 71.31,4.94 71.4,4.89 71.5,4.83 71.6,4.79 71.75,4.74 71.9,4.7 72.05,4.67 72.21,4.64 72.36,4.61 72.52,4.58 72.67,4.55 72.89,4.51 73.12,4.47 73.34,4.43 73.57,4.39 73.79,4.35 74.02,4.32 74.24,4.29 74.43,4.26 74.62,4.24 74.8,4.22 74.99,4.2 75.17,4.19 75.36,4.17 75.55,4.15 75.78,4.14 76.02,4.12 76.25,4.11 76.49,4.1 76.72,4.09 76.95,4.07 77.19,4.05 77.42,4.03 77.65,4 77.88,3.97 78.11,3.94 78.33,3.91 78.56,3.88 78.79,3.85 79.01,3.83 79.22,3.8 79.44,3.77 79.65,3.75 79.87,3.72 80.08,3.7 80.3,3.68 80.52,3.67 80.74,3.67 80.96,3.67 81.18,3.67 81.4,3.67 81.62,3.67 81.84,3.65 82,3.63 82.17,3.61 82.33,3.59 82.49,3.57 82.65,3.54 82.81,3.51 82.98,3.48 v83.41,3.01
  Bottom 0.5: 71.61,11.97 v71.66,11.9
/WAIT  (via drill 0.9)
  Top 0.5: K1.A19 130.22,92.45 129.83,91.85 129.33,91.41 128.04,90.79 126.81,90.03 125.67,89.18 124.29,87.95 123.11,86.66 117.95,80.11 116.92,78.85 116.07,78.09 114.66,77.38 113.87,77.15 R17.1 111.23,77.76 109.88,78.41 108.47,78.88 107.21,79.1 90.72,80.61 88.08,80.79 85.94,80.76 v80.87,80.32 80,79.29 79.11,78.53 77.88,77.93 76.32,77.59 74.8,77.51 72.3,77.81 70.23,78.19 67.95,78.78 66.51,79.41 65.33,80 v64.04,80.8 | T1.2 47.15,94.9 47.62,94.58 48.41,94.31 52.72,94.31 54.37,94.2 56.65,93.88 58.44,93.26 60.12,92.23 v64.04,88.9
  Bottom 0.5: v64.04,88.9 64.03,88.52 63.96,81.03 v64.04,80.8 | v80.87,80.32 81,79.64 81.29,78.55 81.35,78.38 81.41,78.21 81.47,78.04 81.53,77.88 81.59,77.71 81.66,77.54 81.71,77.37 81.76,77.22 81.81,77.07 81.86,76.92 81.9,76.77 81.95,76.62 81.99,76.47 82.04,76.33 82.1,76.16 82.16,76 82.44,74.67 82.64,73.28 82.78,71.92 82.88,70.25 82.88,44.38 82.89,42.31 83.01,40.79 83.16,39.4 83.38,37.98 83.67,36.61 83.96,35.63 84.25,34.91 84.31,34.68 84.4,34.42 84.5,34.16 84.6,33.9 84.7,33.65 84.81,33.39 84.91,33.14 85.03,32.88 85.13,32.66 85.24,32.45 85.36,32.23 85.47,32.01 85.59,31.8 85.71,31.58 85.83,31.37 85.95,31.17 86.08,30.97 86.2,30.77 86.33,30.58 86.46,30.38 86.59,30.19 86.73,30 86.86,29.82 87,29.7 87.14,29.53 87.28,29.31 87.43,29.15 87.58,28.98 87.72,28.81 IC3.24
/WR  (via drill 0.9)
  Top 0.5: IC1.8 30.58,69.86 30.88,69.88 31.18,69.91 31.48,69.94 31.78,69.97 32.08,70.02 32.37,70.08 32.65,70.16 32.88,70.24 33.1,70.32 33.32,70.41 33.53,70.5 33.75,70.6 33.96,70.71 34.16,70.83 34.36,70.98 34.54,71.15 34.73,71.32 34.9,71.5 35.08,71.69 35.24,71.88 35.4,72.07 35.56,72.31 35.71,72.55 35.85,72.81 35.98,73.07 36.1,73.33 36.22,73.6 36.33,73.88 36.43,74.16 36.53,74.44 36.63,74.72 36.72,75 36.82,75.28 36.91,75.57 37,75.85 37.1,76.15 37.19,76.45 37.28,76.75 37.38,77.05 37.47,77.35 37.55,77.66 37.64,77.96 37.73,78.34 37.82,78.73 37.91,79.12 37.99,79.51 38.07,79.89 38.15,80.28 38.24,80.67 38.33,81.04 38.41,81.41 38.76,82.49 39.11,83.51 39.55,84.54 40.25,85.39 41.1,85.98 41.84,86.25 42.57,86.42 45.5,86.42 45.89,86.48 46.38,86.8 47.03,87.36 47.73,87.62 50.37,87.63 52.11,87.21 53.81,86.57 60.09,83.13 61.61,82.63 63.67,82.34 64.55,82.14 65.31,81.81 66.25,81.17 67.31,80.43 68.71,79.67 69.74,79.32 71.71,78.88 73.26,78.61 74.35,78.7 75.17,79.08 75.87,79.76 77.49,81.72 77.99,82.19 v78.49,82.55 80.6,82.84 82.97,82.84 88.52,82.72 107.9,81.03 109.62,80.76 110.67,80.43 111.73,79.91 112.4,79.67 113.4,79.55 114.31,79.64 115.25,80.2 115.89,80.79 116.34,81.46 116.78,82.31 v117.38,83.34 121.59,88.56 122.53,89.59 123.44,90.35 124.17,90.82 124.79,91.32 125.08,91.85 125.16,92.55 K1.A17 | IC4B.10 104.83,36.97 104.95,36.24 105.27,35.56 105.71,34.95 111.91,28.72 112.7,28.05 113.43,27.61 114.02,27.43 114.6,27.43 118.74,27.43 119.47,27.52 120,27.73 120.47,28.02 120.88,28.37 v125.48,32.86 | IC4A.10 128.49,33.82 129.37,31.81 130.14,30.72 131.06,29.87 132.01,29.38 133.13,28.99 v134.53,28.73
  Bottom 0.5: 77.88,82.4 77.86,82.39 77.83,82.38 77.73,82.33 77.63,82.27 77.54,82.19 77.45,82.12 77.36,82.04 77.28,81.95 77.22,81.86 77.17,81.78 77.14,81.69 77.12,81.59 77.1,81.49 77.08,81.39 77.05,81.3 77.03,81.2 77,81.11 76.97,81.01 76.94,80.92 76.91,80.82 76.88,80.73 76.85,80.63 76.84,80.54 76.83,80.44 76.84,80.35 76.84,80.25 76.85,80.16 76.86,80.06 76.87,79.97 76.89,79.88 76.9,79.75 76.92,79.63 76.95,79.5 76.97,79.38 77,79.25 77.03,79.14 77.08,79.02 77.15,78.9 77.25,78.78 77.35,78.66 77.46,78.56 77.58,78.45 77.68,78.33 77.78,78.22 77.9,78.07 78.02,77.93 78.14,77.78 78.25,77.63 78.36,77.48 78.48,77.33 78.59,77.18 78.73,76.98 78.87,76.78 79.01,76.58 79.14,76.38 79.28,76.17 79.41,75.97 79.54,75.76 79.66,75.54 79.78,75.32 79.9,75.1 80.28,74.14 80.56,73.14 80.85,71.9 81.05,70.69 81.12,69.25 81.12,43.25 81.17,41.87 81.25,40.18 81.47,38.52 81.76,36.66 82.13,34.78 82.42,33.68 82.66,32.96 82.78,32.57 82.88,32.41 82.96,32.17 83.04,31.94 83.12,31.7 83.2,31.46 83.28,31.23 83.37,30.99 83.44,30.8 83.51,30.6 83.58,30.4 83.66,30.2 83.73,30.01 83.81,29.81 83.89,29.62 84,29.37 84.13,29.12 84.26,28.88 84.39,28.64 84.52,28.4 84.65,28.16 84.79,27.92 84.92,27.69 85.05,27.46 85.18,27.24 85.32,27.02 85.45,26.79 85.59,26.57 85.73,26.35 85.87,26.16 86.01,25.97 86.16,25.78 86.3,25.59 86.44,25.41 86.59,25.22 86.73,25.03 86.87,24.84 87,24.65 87.14,24.46 87.27,24.27 87.41,24.08 87.54,23.89 87.67,23.7 IC3.22 | 77.88,82.4 77.9,82.41 77.93,82.42 77.95,82.42 77.97,82.43 | 77.88,82.4 v78.49,82.55 | 134.99,51.03 135.05,51.18 135.1,51.34 135.15,51.49 135.2,51.72 135.24,51.96 135.27,52.2 135.29,52.44 135.31,52.68 135.33,52.92 135.35,53.16 135.36,53.41 135.36,53.66 135.36,53.91 135.35,54.16 135.35,54.41 135.35,54.66 135.35,54.9 135.36,55.14 135.37,55.38 135.38,55.62 135.4,55.86 135.41,56.1 135.42,56.34 135.42,56.58 135.41,56.77 135.39,56.96 135.38,57.15 135.36,57.34 135.34,57.53 135.31,57.73 135.28,57.92 135.25,58.11 135.2,58.3 135.16,58.49 135.11,58.68 135.06,58.88 135,59.06 134.95,59.25 134.89,59.44 134.83,59.63 134.77,59.81 134.71,60 134.65,60.18 134.57,60.36 134.48,60.53 134.34,60.72 134.18,60.9 134.01,61.06 133.82,61.22 133.62,61.37 IC4.27
  Bottom 0.5: 134.99,51.03 134.92,50.88 134.86,50.73 134.8,50.57 134.75,50.42 134.71,50.3 134.67,50.17 134.62,50.05 134.59,49.93 134.55,49.8 134.51,49.68 134.48,49.55 134.44,49.28 134.42,49 134.41,48.72 134.41,48.45 134.41,48.17 134.41,47.89 134.41,47.61 134.42,47.31 134.43,47.02 134.44,46.72 134.45,46.42 134.46,46.13 134.47,45.83 134.48,45.53 134.48,45.22 134.48,44.9 134.47,44.59 134.46,44.27 134.45,43.96 134.46,43.64 134.48,43.33 134.51,43.12 134.54,42.92 134.58,42.72 134.62,42.52 134.66,42.32 134.7,42.12 134.75,41.92 134.82,41.65 134.91,41.38 135,41.12 135.1,40.85 135.19,40.59 135.28,40.32 135.35,40.05 135.43,39.7 135.5,39.35 135.56,38.99 135.62,38.64 135.67,38.28 135.71,37.93 135.75,37.57 135.77,37.32 135.78,37.07 135.79,36.83 135.8,36.58 135.81,36.33 135.82,36.08 135.82,35.83 135.81,35.49 135.8,35.14 135.78,34.8 135.76,34.45 135.74,34.11 135.72,33.76 135.69,33.42 135.64,33.06 135.59,32.69 135.54,32.33 135.48,31.96 135.42,31.6 135.36,31.24 135.28,30.88 135.22,30.62 135.16,30.36 135.1,30.1 135.03,29.84 134.96,29.59 134.89,29.33 134.81,29.07 v134.53,28.73 | IC4.23 134.99,51.03 | v125.48,32.86 125.24,33.63 125.12,34.25 125.12,35.88 | 125.12,35.88 125.12,47.25 125.07,48.22 124.82,49.53 124.44,50.83 123.8,52.7 123.25,54.43 122.71,56.41 122.46,57.57 122.15,59.96 121.9,62.39 121.75,64.42 121.54,67.52 121.24,70.36 120.99,72.06 120.63,73.76 120.17,75.53 119.62,77.56 118.99,79.75 118.6,80.99 118.1,82.18 v117.38,83.34 | IC4A.10 125.12,35.88
A0  (via drill 0.9)
  Top 0.5: IC3.30 RP2.10 IC4B.7 97.85,43.62 98.4,43.72 99.34,44.02 100.23,44.43 101.23,45.18 101.82,45.73 102.23,46.32 102.6,46.91 103.37,48.65 103.64,49.3 103.88,49.73 104.3,49.99 105.38,50 106.11,49.81 v110.24,47.62 113.69,42.75 114.31,42.05 115.07,41.49 115.92,41.14 116.62,41 IC4.10 IC4A.7
  Bottom 0.5: K1.B7 100.08,92.71 100.39,92.39 100.87,92.07 101.19,91.75 101.42,91.14 101.42,91.02 101.42,90.91 101.43,90.78 101.38,87.5 101.45,86.05 101.62,84.82 101.98,83.8 102.4,82.42 103.42,80.06 104.65,77.35 106.03,74.57 108,70.55 109.05,68.44 109.69,66.75 110.04,65.13 110.28,63.05 110.53,59.88 110.67,56.6 110.74,52.87 110.57,50.72 v110.24,47.62 110,45.72 109.92,43.99 109.83,41.62 109.79,38.58 109.67,35.32 109.55,33.66 109.52,33.42 109.46,33.16 109.39,32.89 109.31,32.63 109.23,32.37 109.14,32.11 109.03,31.86 108.92,31.62 108.78,31.4 108.63,31.19 108.47,30.99 108.3,30.79 108.13,30.59 107.96,30.4 107.78,30.21 107.61,30.05 107.43,29.88 107.25,29.73 107.07,29.57 106.89,29.42 106.7,29.28 105.14,28.56 98.63,26.65 97.58,26.11 96.89,25.61 96.29,24.97 96.06,24.5 95.98,23.82 95.97,22.68 96.1,22.09 96.48,21.62 97.32,21.45 110.93,21.45 112.16,21.41 113.6,21.03 114.57,20.57 115.46,19.76 116.12,18.75 RP6.8
A1  (via drill 0.9)
  Top 0.5: IC3.31 RP2.9 97.91,44.92 98.48,45.02 99.01,45.16 99.66,45.45 100.25,45.75 100.87,46.24 101.29,46.71 101.52,47.04 101.92,47.85 102.76,49.54 103.25,50.6 103.62,51.03 104.15,51.3 IC4B.15 105.98,51.23 106.51,51.03 110.53,49.12 111.14,48.59 v114.05,44.6 114.99,43.34 115.66,42.72 116.31,42.37 117.12,42.25 120.5,42.25 121.06,42.35 121.69,42.64 122.11,43.02 126.21,47.73 126.62,48.06 127.15,48.34 IC4A.15 | IC4.3 v113.57,60.16
  Bottom 0.5: K1.B8 102.62,92.87 103.19,92.33 103.67,91.77 103.89,91.12 103.89,90.48 103.83,89.9 103.76,89.77 103.55,88.96 103.55,88.55 103.72,88.01 104.14,87.23 104.65,86.4 105.13,85.71 105.63,85.09 106.24,84.29 106.98,83.15 107.9,81.07 108.69,79.03 109.42,76.91 110.3,75.25 111.46,73.51 112.39,71.87 113.13,70.31 113.5,69 113.86,67.77 114,66.38 114,60.12 | 114,44.64 v114.05,44.6 | 114,60.12 114,45 v114.05,44.6 | v113.57,60.16 114,60.12 | v114.05,44.6 114.02,33.95 113.91,32.91 113.48,31.93 112.32,30.47 110.38,28.95 107.82,27.67 105.44,26.66 104.21,26.3 103.03,26.05 99.64,25.32 98.81,25.03 98.4,24.79 97.85,24.26 RP7.1
A2
  Top 0.5: IC3.32 RP2.8 IC4B.6 98,46.18 98.77,46.34 99.46,46.63 100.13,47.1 100.58,47.59 100.95,48.22 102.15,50.56 102.68,51.52 103.05,52.03 103.49,52.34 103.84,52.48 104.22,52.56 104.43,52.59 104.87,52.6 105.33,52.61 105.56,52.6 105.76,52.59 106.42,52.26 111.11,49.94 111.7,49.5 116.39,43.81 116.95,43.54 IC4.9 IC4A.6
  Bottom 0.5: K1.B9 105,92.5 105.15,91.69 105.47,90.81 106,89.93 107.02,88.62 107.83,87.64 108.46,86.65 109.1,85.31 109.13,85.31 109.63,83.87 110.08,82.49 110.59,81.35 111.25,80.12 111.88,79.37 112.35,78.88 113.16,78.37 113.82,77.8 114.24,77.07 114.8,75.41 115.3,73.62 115.75,71.33 116.03,69.92 116.21,68.65 116.32,67.03 116.25,63.75 116.25,46.62 116.39,45.83 116.74,44.78 117.15,44.04 IC4.9 117.75,43.38 117.05,42.64 116.58,41.8 116.28,40.9 116.25,40.38 116.25,31.5 116.18,30.65 116.04,29.84 115.71,29.22 115.13,28.67 114.25,28.05 113.07,27.43 111.08,26.52 108.91,25.55 107.85,25.23 106.76,25.08 106,24.76 105.39,24.32 105.06,23.88 RP7.4
A3
  Top 0.5: IC3.33 RP2.7 95,47.88 95.45,47.63 95.89,47.51 96.62,47.5 97.8,47.48 98.85,47.73 99.6,48.2 100.07,48.75 100.48,49.46 101.27,51 101.68,51.76 102.05,52.4 102.64,53.19 103.21,53.6 103.58,53.74 104,53.8 IC4B.16 106.07,53.64 111.82,50.59 112.46,50.06 116.22,45.45 116.81,44.92 117.12,44.75 120.5,44.75 121.26,44.8 121.67,44.94 122.09,45.22 126.33,50.01 126.66,50.4 127.09,50.79 IC4A.16 128.55,51.25 129.1,51.46 132,53.48 132.38,53.64 IC4.24
  Bottom 0.5: K1.B10 107.58,93.65 107.74,93.34 107.9,93.02 108.23,92.14 108.78,91.5 110.17,90.62 112.58,89.64 114.82,88.5 116.94,87.19 118.25,86.22 118.96,85.46 119.56,84.57 120.11,83.51 120.86,81.54 121.65,79.06 122.31,76.56 122.9,73.58 123.19,71.51 123.53,68.51 123.66,65.12 123.87,62.88 124.2,60.6 124.63,58.06 125.1,56.07 125.61,54.49 126.19,53.2 127.04,51.94 IC4A.16 | RP6.6 111.35,18.56 110.79,19.27 110.08,19.73 109.07,20.14 108.05,20.29 106.84,20.34 96.76,20.33 96.14,20.44 95.61,20.69 95.22,21.25 95.12,21.71 95.04,22.22 95.04,24.65 95.17,25.14 95.42,25.56 95.83,26.07 96.29,26.53 97.76,27.85 98.16,28.45 98.57,29.22 98.77,29.98 98.97,31.19 99.08,32.16 99.28,33.12 99.79,34.29 100.09,35.56 100.24,36.52 101.16,46.16 101.66,49.41 102.07,50.47 102.63,51.44 103.54,52.45 IC4B.16
A4  (via drill 0.9)
  Top 0.5: IC3.34 RP2.6 95.18,49.34 95.67,48.99 96.2,48.79 96.53,48.71 IC4B.5 98.2,48.87 98.79,49.16 99.26,49.62 99.64,50.16 100.01,50.75 100.66,51.99 101.05,52.7 101.4,53.33 101.89,54.05 102.58,54.72 103.05,54.96 103.47,55.06 104.08,55.1 104.35,55.13 104.63,55.14 104.91,55.15 105.19,55.14 106.12,54.96 112.4,51.38 113.02,50.88 116.56,46.42 116.64,46.35 116.74,46.29 116.83,46.23 116.93,46.18 117.03,46.12 117.13,46.08 117.23,46.05 117.3,46.04 117.37,46.04 117.44,46.04 IC4.8 IC4A.5 120.73,46.06 120.97,46.12 121.46,46.28 121.95,46.69 126.8,52.15 127.05,52.34 127.48,52.46 127.74,52.45 128.13,52.46 128.49,52.54 132.12,54.84 132.57,54.96 133.74,55.04 134.45,55.23 135.1,55.72 135.5,56.31 135.79,57.04 135.94,57.94 135.94,62.65 135.91,63.56 135.73,64.5 135.44,65.35 134.94,66.44 134.18,67.93 133.21,70.04 132.97,71.1 132.97,72.25 133.03,73.07 133.18,73.74 133.44,74.53 134,75.65 134.59,76.47 135.85,78.44 136.61,79.7 137.23,80.84 137.76,82.31 138.14,83.54 138.46,85.45 v138.65,88.58
  Bottom 0.5: K1.B22 137.97,92.31 v138.65,88.58 | IC4B.5 96.64,48.59 96.34,48.29 96.03,47.78 95.88,47.07 95.88,36.22 96.08,35.56 96.54,34.69 96.64,33.93 96.49,33.22 96.03,32.51 95.32,31.5 94.77,30.64 94.46,30.03 94.26,29.32 94.11,28.43 94.1,20.77 94.26,20.08 94.67,19.53 95.27,19.27 96.29,19.17 104.61,19.17 105.47,18.87 106.13,18.46 106.68,17.85 106.94,17.4 RP6.4
A5  (via drill 0.9)
  Top 0.5: IC3.35 RP2.5 95.18,51.09 95.73,50.48 96.16,50.18 96.65,50 97.77,50.02 98.4,50.28 98.93,50.85 99.58,52.05 100.85,54.21 101.6,55.27 102.29,55.94 102.96,56.25 103.6,56.35 IC4B.17 105.92,56.31 106.3,56.16 112.84,52.35 113.58,51.7 116.57,47.86 116.92,47.39 117.25,47.25 120.5,47.25 121.1,47.42 121.46,47.71 121.65,47.91 126.03,52.91 126.62,53.44 127.17,53.64 IC4A.17 128.39,53.8 128.92,54.03 131.81,55.98 132.3,56.17 IC4.25 133.77,56.2 134.25,56.49 134.58,57 134.73,57.53 134.79,58.04 134.79,63 134.71,63.79 134.38,64.91 133.77,66.23 132.86,68.2 132.48,69.19 132.24,70.13 132.12,70.9 132.12,71.75 132.18,73.01 132.42,74.27 132.71,75.06 133.5,76.56 134.38,77.85 135.91,80.49 136.44,81.78 136.79,83.13 136.97,84.07 136.94,85.19 v136.75,86.67
  Bottom 0.5: K1.B21 135.37,92.31 v136.75,86.67 | RP2.5 92.89,54.84 93.25,54.63 93.5,54.28 93.8,53.62 93.8,38.14 93.7,37.13 93.3,35.96 93.14,34.75 93.12,20 93.25,19.27 93.55,18.66 94.06,18.21 94.72,17.95 95.63,17.85 100.09,17.85 100.95,17.7 101.51,17.5 101.87,17.09 RP6.2
A6/INT  (via drill 0.9)